# Altium schematic sheet RF.SchDoc
size A4; SheetNumber: 5; SheetTotal: 11
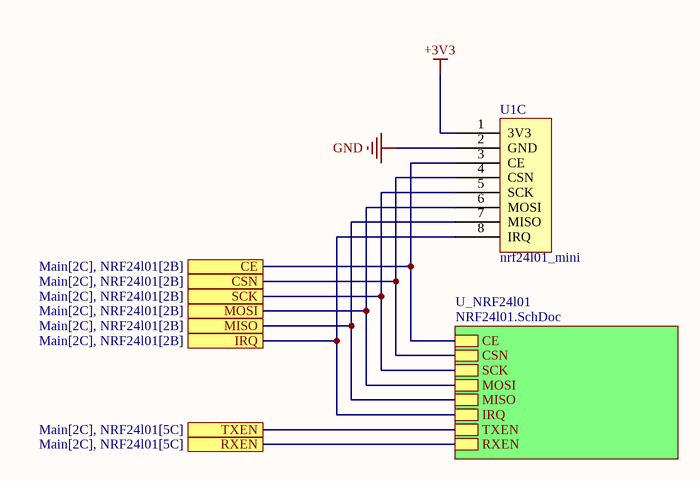
[diagram p0: RF.SchDoc]

## Parts
U1  nrf24l01_mini  [nr24l01_mini]  (part C of 3)

## Sub-sheets
U_NRF24l01 = NRF24l01.SchDoc: CE, CSN, SCK, MOSI, MISO, IRQ, TXEN, RXEN

## Ports
CE (see Main[2C], NRF24l01[2B]), CSN (see Main[2C], NRF24l01[2B]), IRQ (see Main[2C], NRF24l01[2B]), MISO (see Main[2C], NRF24l01[2B]), MOSI (see Main[2C], NRF24l01[2B]), RXEN (see Main[2C], NRF24l01[5C]), SCK (see Main[2C], NRF24l01[2B]), TXEN (see Main[2C], NRF24l01[5C])

## Nets
+3V3: U1.1(3V3)
GND: U1.2(GND)
CE: U1.3(CE) ; port CE, sheet U_NRF24l01/CE
CSN: U1.4(CSN) ; port CSN, sheet U_NRF24l01/CSN
IRQ: U1.8(IRQ) ; port IRQ, sheet U_NRF24l01/IRQ
MISO: U1.7(MISO) ; port MISO, sheet U_NRF24l01/MISO
MOSI: U1.6(MOSI) ; port MOSI, sheet U_NRF24l01/MOSI
RXEN: port RXEN, sheet U_NRF24l01/RXEN
SCK: U1.5(SCK) ; port SCK, sheet U_NRF24l01/SCK
TXEN: port TXEN, sheet U_NRF24l01/TXEN